# Altium project Door Sensor PCB V2.PrjPcb
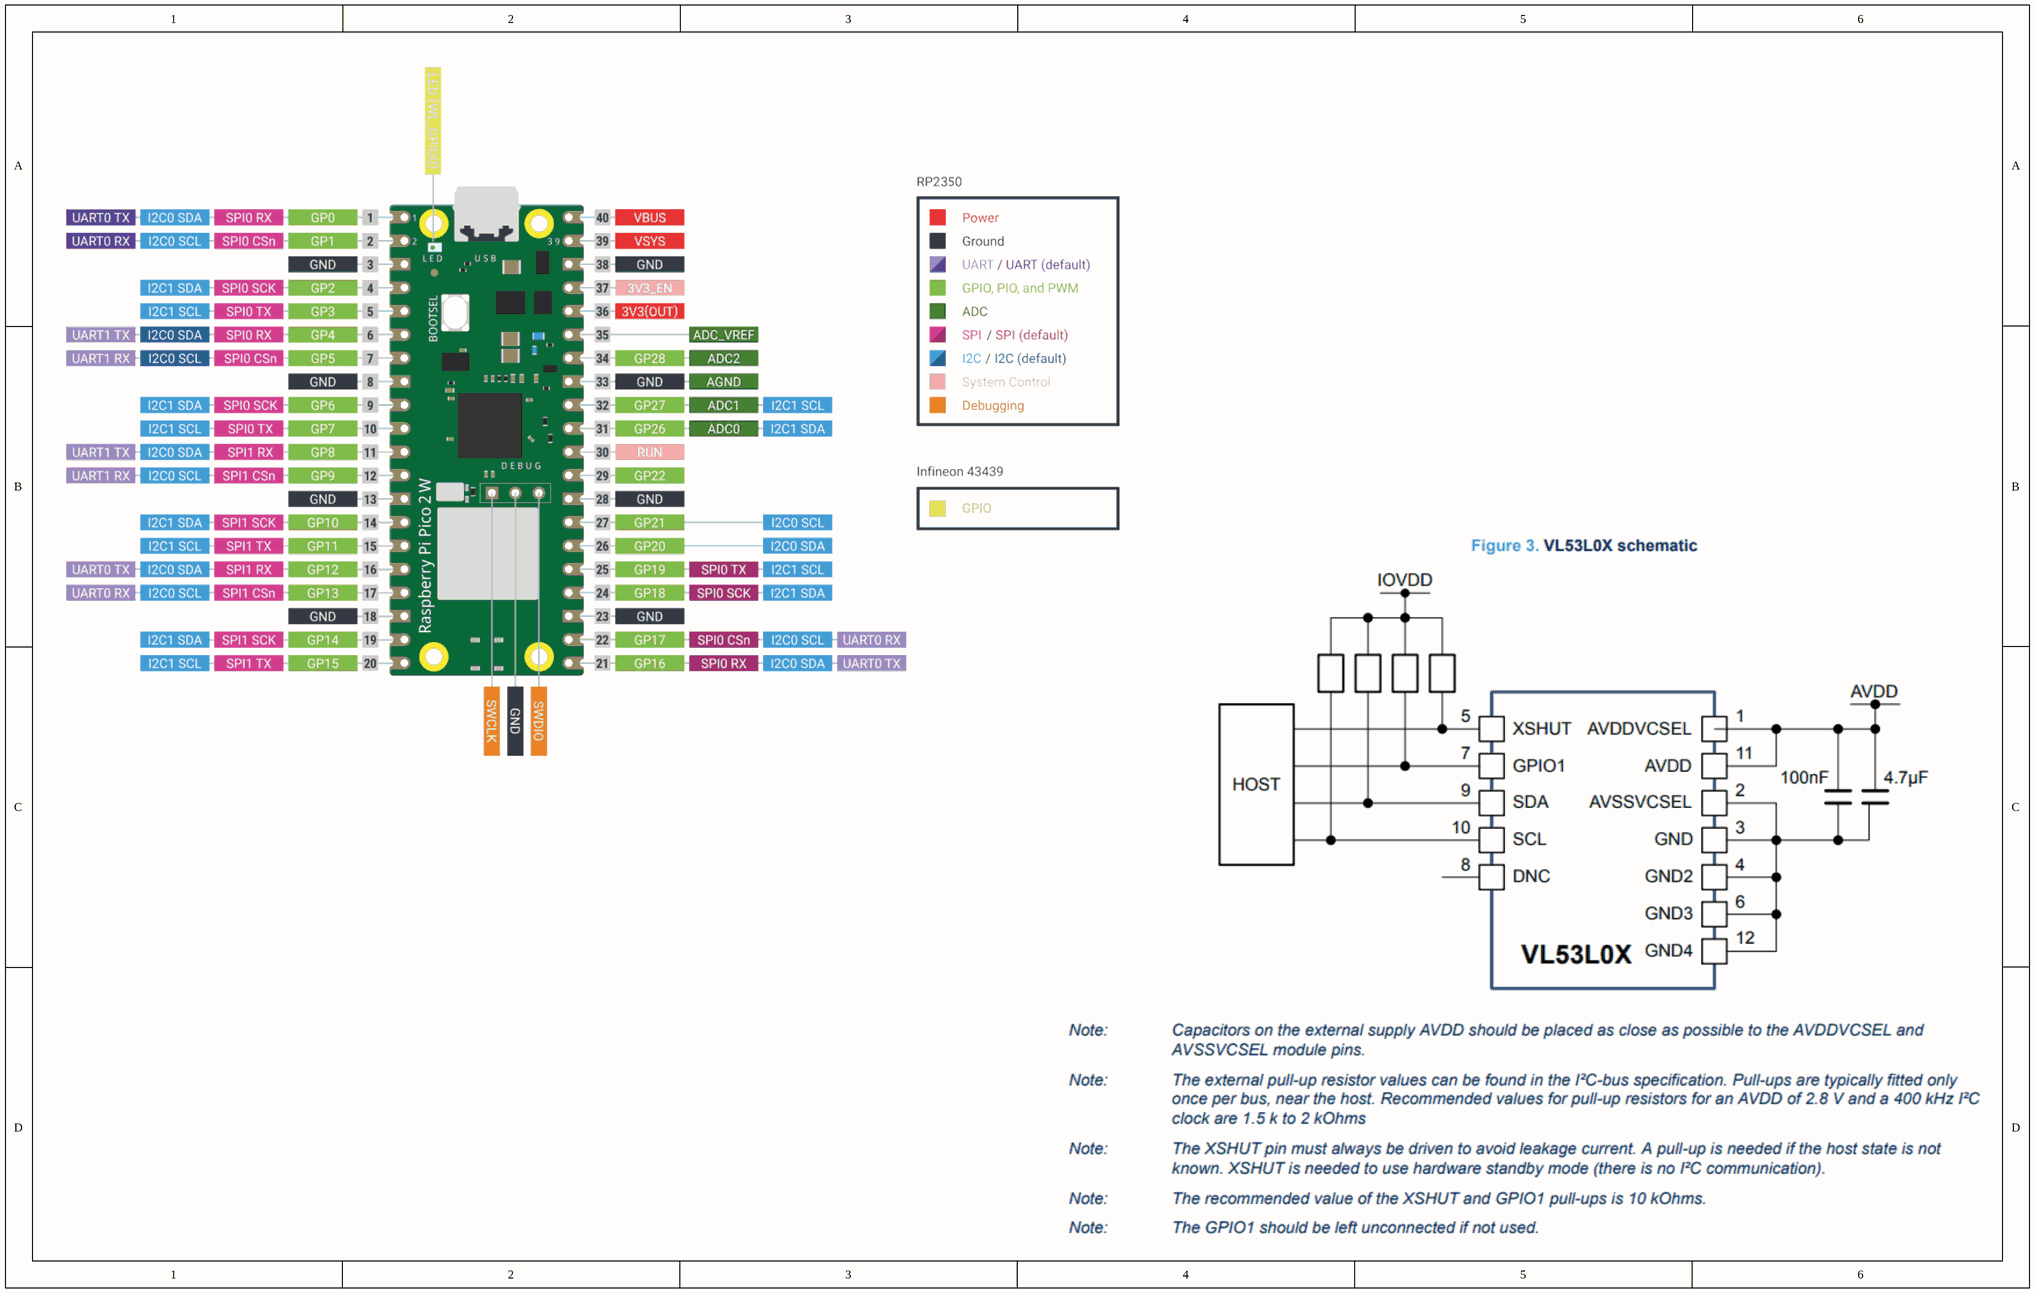
[diagram p0: Overview.SchDoc]
2 sheets, 24 parts. Net scope: global (net labels, ports and power ports of the same name join across sheets).
Board file: main.PcbDoc
Sheets:
  Overview.SchDoc
  Pico 2W and Sensor.SchDoc

## Sheet Overview.SchDoc
size B; SheetNumber: 1; SheetTotal: 4

## Sheet Pico 2W and Sensor.SchDoc
size B; SheetNumber: 2; SheetTotal: 4
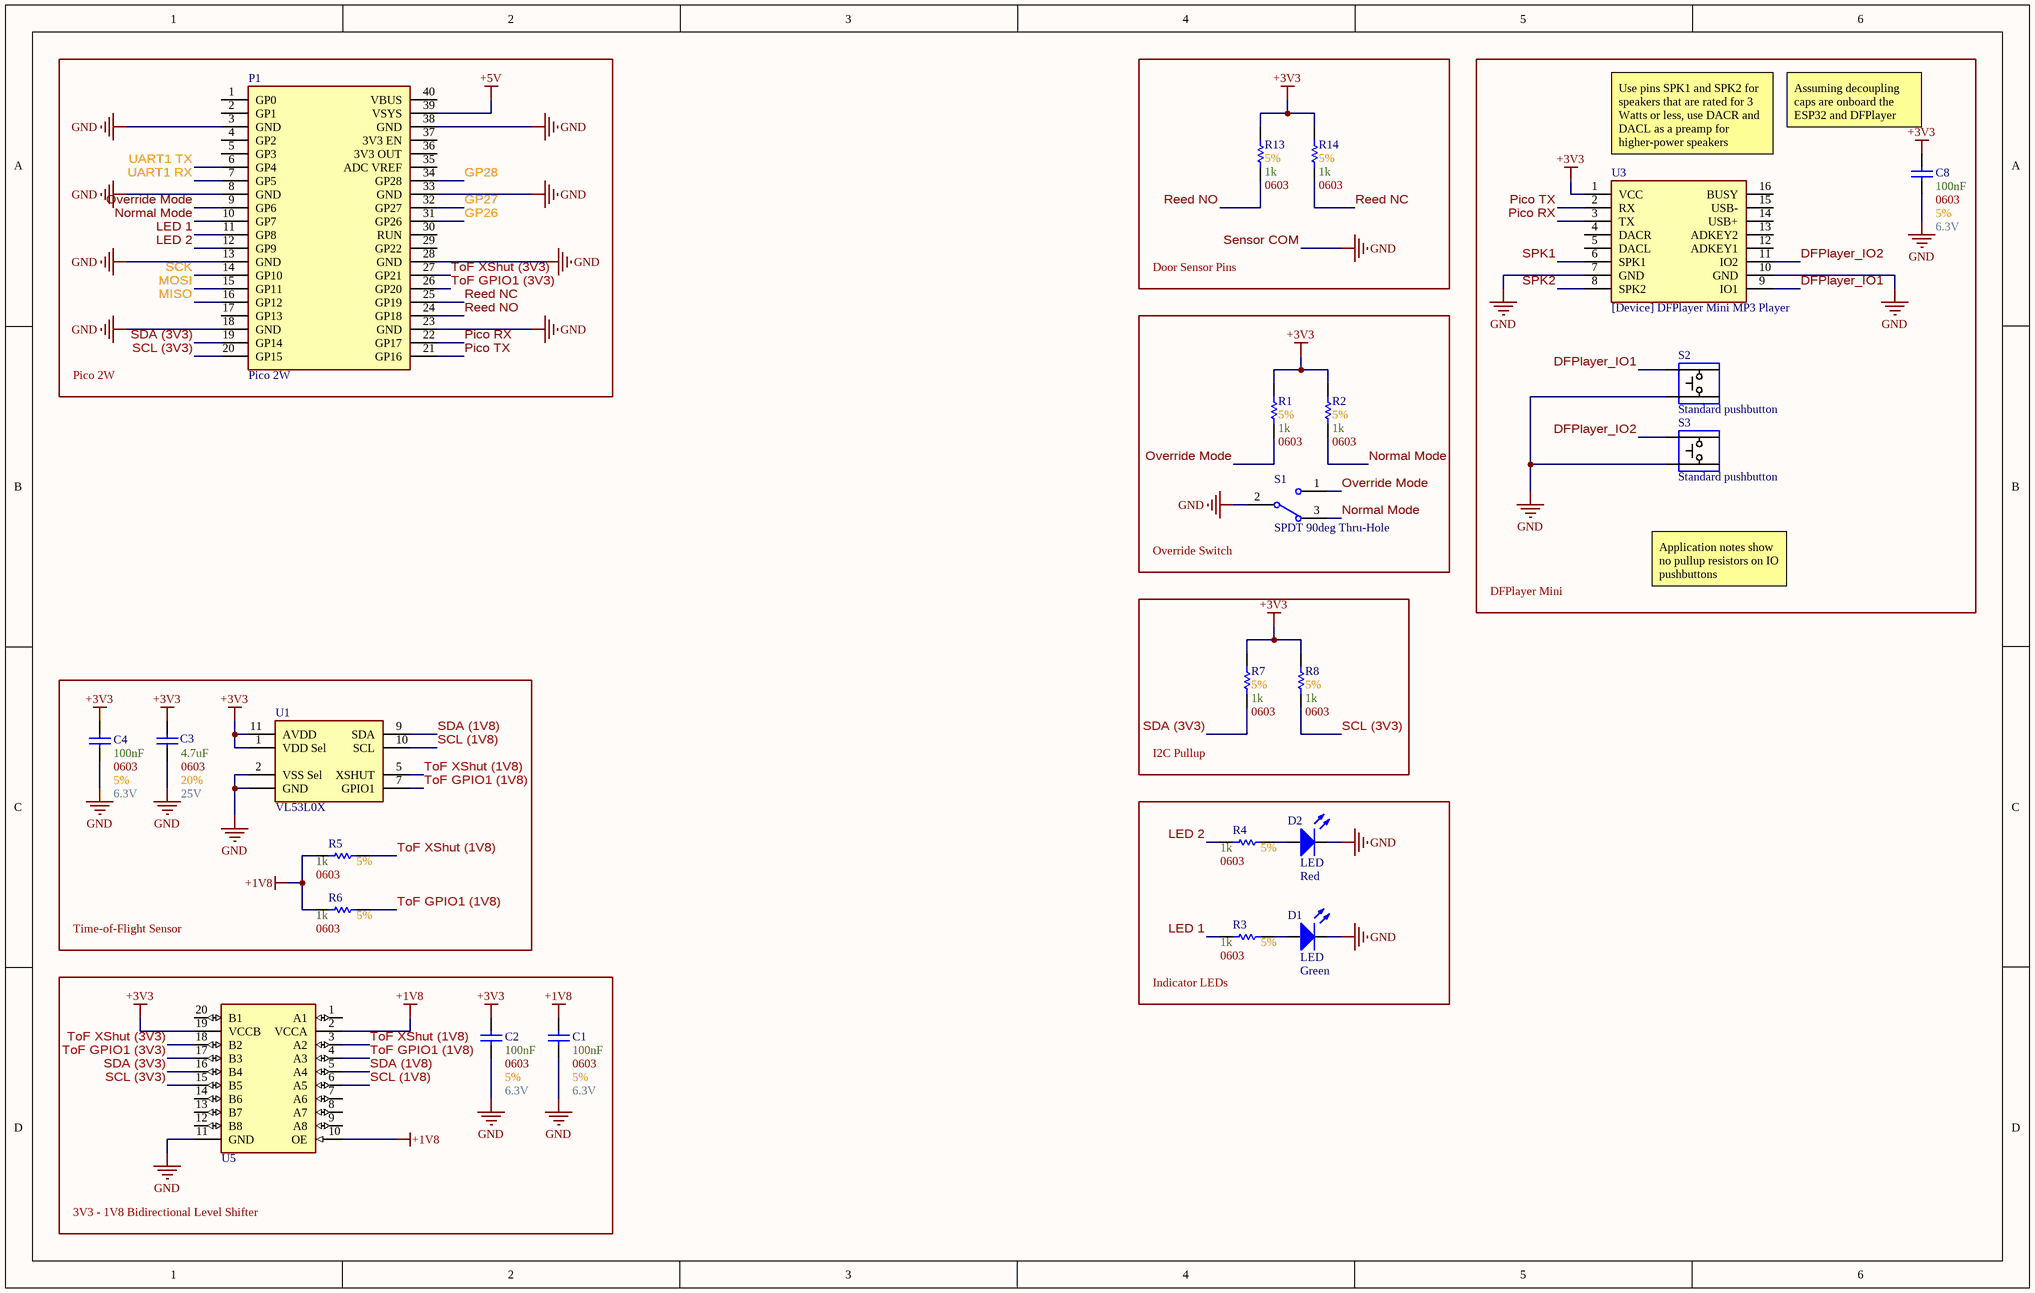
[diagram p1: Pico 2W and Sensor.SchDoc]

### Parts
C1  Size Package: 0603  Capacitance: 100nF  Voltage: 6.3V  Tolerance: 5%  [[Cap] SMD 0603]  (hidden comment: [Cap] SMD Nonpolarized)
C2  Size Package: 0603  Capacitance: 100nF  Voltage: 6.3V  Tolerance: 5%  [[Cap] SMD 0603]  (hidden comment: [Cap] SMD Nonpolarized)
C3  Voltage: 25V  Tolerance: 20%  Size Package: 0603  Capacitance: 4.7uF  [[Cap] SMD 0603]  (hidden comment: SMD Nonpolarized)
C4  Size Package: 0603  Capacitance: 100nF  Voltage: 6.3V  Tolerance: 5%  [[Cap] SMD 0603]  (hidden comment: [Cap] SMD Nonpolarized)
C8  Size Package: 0603  Capacitance: 100nF  Voltage: 6.3V  Tolerance: 5%  [[Cap] SMD 0603]  (hidden comment: [Cap] SMD Nonpolarized)
D1  LED  Color: Green  [[LED] Thru-Hole, 3mm, Green]
D2  LED  Color: Red  [[LED] Thru-Hole, 3mm, Red]
P1  Pico 2W  [[Device] RP Pico 2W]
R1  Tolerance: 5%  Resistance: 1k  Size Package: 0603  [[Res] SMD 0603]  (hidden comment: [Res] SMD Resistor)
R2  Tolerance: 5%  Resistance: 1k  Size Package: 0603  [[Res] SMD 0603]  (hidden comment: [Res] SMD Resistor)
R3  Tolerance: 5%  Resistance: 1k  Size Package: 0603  [[Res] SMD 0603]  (hidden comment: [Res] SMD Resistor)
R4  Tolerance: 5%  Resistance: 1k  Size Package: 0603  [[Res] SMD 0603]  (hidden comment: [Res] SMD Resistor)
R5  Tolerance: 5%  Resistance: 1k  Size Package: 0603  [[Res] SMD 0603]  (hidden comment: [Res] SMD Resistor)
R6  Tolerance: 5%  Resistance: 1k  Size Package: 0603  [[Res] SMD 0603]  (hidden comment: [Res] SMD Resistor)
R7  Tolerance: 5%  Resistance: 1k  Size Package: 0603  [[Res] SMD 0603]  (hidden comment: [Res] SMD Resistor)
R8  Tolerance: 5%  Resistance: 1k  Size Package: 0603  [[Res] SMD 0603]  (hidden comment: [Res] SMD Resistor)
R13  Tolerance: 5%  Resistance: 1k  Size Package: 0603  [[Res] SMD 0603]  (hidden comment: [Res] SMD Resistor)
R14  Tolerance: 5%  Resistance: 1k  Size Package: 0603  [[Res] SMD 0603]  (hidden comment: [Res] SMD Resistor)
S1  SPDT 90deg Thru-Hole  [[Switch] SPDT Toggle Switch 90deg]
S2  Standard pushbutton  [[Switch] Pushbutton]
S3  Standard pushbutton  [[Switch] Pushbutton]
U1  VL53L0X  [[Device] Time-of-Flight Sensor]
U3  [Device] DFPlayer Mini MP3 Player  [[Device] DFPlayer Mini MP3 Player]
U5  [IC] Level Shifter (2)  [[IC] Level Shifter (2)]  (value not drawn)

### Blocks framed on the sheet
Pico 2W: P1
Door Sensor Pins: R13 R14
DFPlayer Mini: C8 S2 S3 U3
Override Switch: R1 R2 S1
I2C Pullup: R7 R8
Time-of-Flight Sensor: C3 C4 R5 R6 U1
Indicator LEDs: D1 D2 R3 R4
3V3 - 1V8 Bidirectional Level Shifter: C1 C2 U5

### Nets
+1V8: C1.2 R5.2 R6.2 U5.2(VCCA) U5.10(OE)
+3V3: C2.2 C3.2 C4.2 C8.2 R1.1 R2.1 R7.1 R8.1 R13.1 R14.1 U1.1(VDD_Sel) U1.11(AVDD) U3.1(VCC) U5.19(VCCB)
+5V: P1.39(VSYS)
GND: C1.1 C2.1 C3.1 C4.1 C8.1 D1.2(K) D2.2(K) P1.3(GND) P1.8(GND) P1.13(GND) P1.18(GND) P1.23(GND) P1.28(GND) P1.33(GND) P1.38(GND) S1.2 S2.2 S3.2 U1.2(VSS_Sel) U1.GND U3.7(GND) U3.10(GND) U5.11(GND)  [also labelled Sensor COM]
DFPlayer_IO1: S2.1 U3.9(IO1)
DFPlayer_IO2: S3.1 U3.11(IO2)
GP26: P1.31(GP26)
GP27: P1.32(GP27)
GP28: P1.34(GP28)
LED 1: P1.11(GP8) R3.2
LED 2: P1.12(GP9) R4.2
MISO: P1.16(GP12)
MOSI: P1.15(GP11)
Normal Mode: P1.10(GP7) R2.2 S1.3
Override Mode: P1.9(GP6) R1.2 S1.1
Pico RX: P1.22(GP17) U3.3(TX)
Pico TX: P1.21(GP16) U3.2(RX)
Reed NC: P1.25(GP19) R14.2
Reed NO: P1.24(GP18) R13.2
SCK: P1.14(GP10)
SCL (1V8): U1.10(SCL) U5.6(A5)
SCL (3V3): P1.20(GP15) R8.2 U5.15(B5)
SDA (1V8): U1.9(SDA) U5.5(A4)
SDA (3V3): P1.19(GP14) R7.2 U5.16(B4)
SPK1: U3.6(SPK1)
SPK2: U3.8(SPK2)
ToF GPIO1 (1V8): R6.1 U1.7(GPIO1) U5.4(A3)
ToF GPIO1 (3V3): P1.26(GP20) U5.17(B3)
ToF XShut (1V8): R5.1 U1.5(XSHUT) U5.3(A2)
ToF XShut (3V3): P1.27(GP21) U5.18(B2)
UART1 RX: P1.7(GP5)
UART1 TX: P1.6(GP4)
NetD1_1: D1.1(A) R3.1
NetD2_1: D2.1(A) R4.1

Not connected (* = marked no-connect by the designer): P1 1(GP0) 2(GP1) 4(GP2) 5(GP3) 17(GP13) 29(GP22) 30(RUN) 35(ADC_VREF) 36(3V3_OUT) 37(3V3_EN) 40(VBUS); U3 4(DACR) 5(DACL) 12(ADKEY1) 13(ADKEY2) 14(USB+) 15(USB-) 16(BUSY); U5 1(A1) 7(A6) 8(A7) 9(A8) 12(B8) 13(B7) 14(B6) 20(B1)

### Notes on the sheet
- (near U3) Use pins SPK1 and SPK2 for speakers that are rated for 3 Watts or less, use DACR and DACL as a preamp for higher-power speakers
- (near C8) Assuming decoupling caps are onboard the ESP32 and DFPlayer
- Application notes show no pullup resistors on IO pushbuttons

### Library data of the parts
C3 = [Cap] SMD Nonpolarized: Supplier 1: DigiKey; Supplier Part Number 1: 490-7203-1-ND
D1 D2 = [LED] Thru-Hole 3mm: 3mm LED; Supplier 1: DigiKey
  D1: Supplier Part Number 1: 732-5008-ND
  D2: Supplier Part Number 1: 1080-1064-ND
P1 = [Device] RP Pico 2W
R1-R8 R13 R14 = [Res] SMD Resistor: Generic; Supplier 1: DigiKey; Supplier Part Number 1: RMCF0603FT1K00DKR-ND
S1 = [Switch] SPDT Toggle Switch 90deg: 100SP1T2B4M6QE
S2 S3 = [Switch] Pushbutton: Supplier 1: DigiKey; Supplier Part Number 1: 450-1650-ND
U1 = [Device] Time-of-Flight Sensor: VL53L0CXV0DH/1; Supplier 1: DigiKey; Supplier Part Number 1: 497-17764-1-ND
U5 = [IC] Level Shifter (2): TXS0108EQPWRQ1; Supplier 1: DigiKey; Supplier Part Number 1: 296-42401-1-ND
C1 C2 C4 C8 = [Cap] SMD Nonpolarized: Supplier 1: DigiKey; Supplier Part Number 1: 311-1088-6-ND
U3 = [Device] DFPlayer Mini MP3 Player: ComponentLink1Description: Datasheet; ComponentLink1URL: https://picaxe.com/docs/spe033.pdf